# EAGLE design tiny_encoder_board (EAGLE 9.4.2)

## Sheet 1 of 3
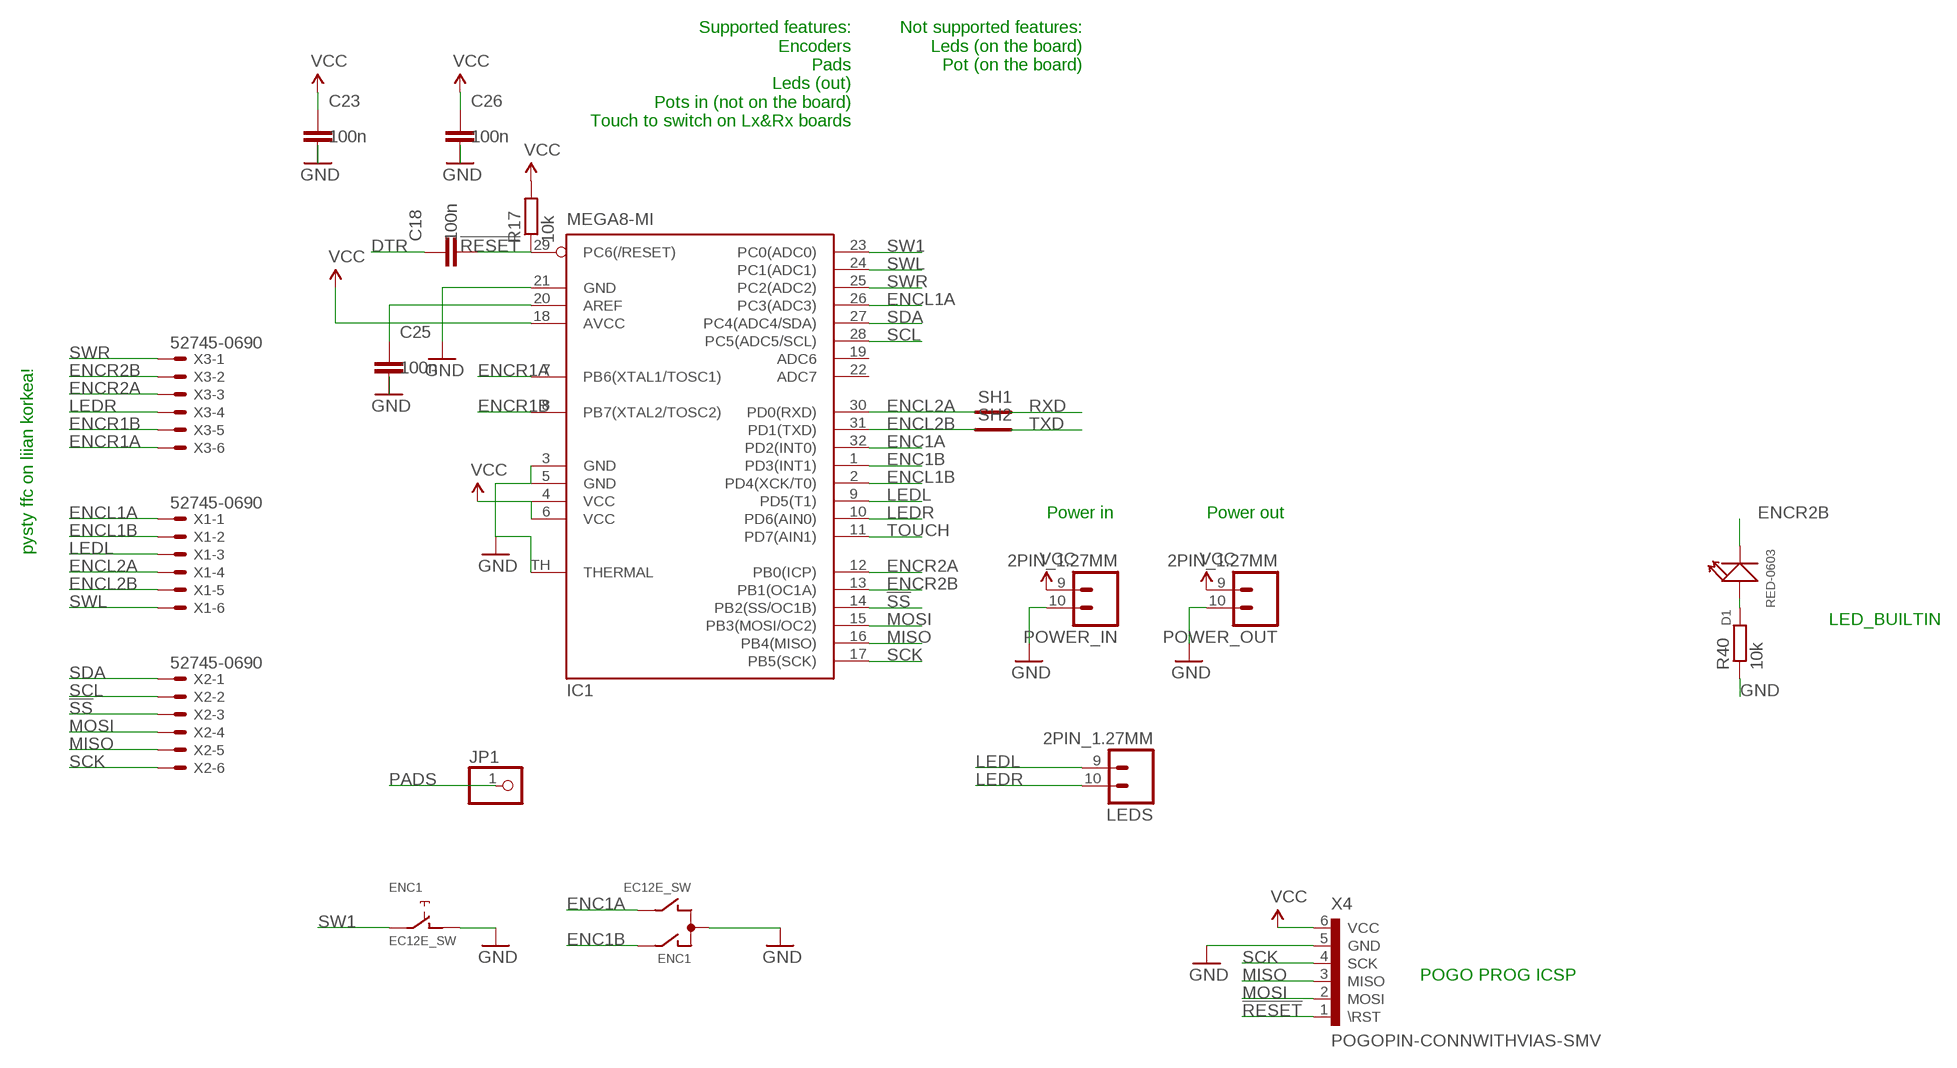
[diagram p0: schematic, sheet 1]

### Parts
C18  100n  C-EUC0402  [C0402]
C23  100n  C-EUC0402  [C0402]
C25  100n  C-EUC0402  [C0402]
C26  100n  C-EUC0402  [C0402]
D1  RED-0603  LED-SMD-RED-DIFFUSED(0603)  [LED-0603]
ENC1  EC12E_SW  [ALPS_EC12E_SW]
IC1  MEGA8-MI  [MLF32-TH]
JP1  PINHD-1X1  [1X01]
LEDS  2PIN_1.27MM  [1X02_1.27MM_NO_SILK]
POWER_IN  2PIN_1.27MM  [1X02_1.27MM_NO_SILK]
POWER_OUT  2PIN_1.27MM  [1X02_1.27MM_NO_SILK]
R17  10k  R-EU_R0402  [R0402]
R40  10k  R-EU_R0402  [R0402]
SH1  SHORT  [SHORT_TOP_8MIL]
SH2  SHORT  [SHORT_TOP_8MIL]
X1  52745-0690  [52745-0690]
X2  52745-0690  [52745-0690]
X3  52745-0690  [52745-0690]
X4  POGOPIN-CONNWITHVIAS-SMV  [POGOPROG-CONN-OH-SMALLERVIAS]

### Nets
!RESET: C18.2 IC1.29(PC6(/RESET)) R17.1 X4.1(\RST)
!SS: IC1.14(PB2(SS/OC1B)) X2.3
AREF: C25.1 IC1.20(AREF)
DTR: C18.1
ENC1A: ENC1.B IC1.32(PD2(INT0)) ; also sheet 3
ENC1B: ENC1.A IC1.1(PD3(INT1)) ; also sheet 3
ENCL1A: IC1.26(PC3(ADC3)) X1.1 ; also sheet 3
ENCL1B: IC1.2(PD4(XCK/T0)) X1.2 ; also sheet 3
ENCL2A: IC1.30(PD0(RXD)) SH1.P$1 X1.4 ; also sheet 3
ENCL2B: IC1.31(PD1(TXD)) SH2.P$1 X1.5 ; also sheet 3
ENCR1A: IC1.7(PB6(XTAL1/TOSC1)) X3.6 ; also sheet 3
ENCR1B: IC1.8(PB7(XTAL2/TOSC2)) X3.5 ; also sheet 3
ENCR2A: IC1.12(PB0(ICP)) X3.3 ; also sheet 3
ENCR2B: D1.- IC1.13(PB1(OC1A)) X3.2 ; also sheet 3
GND: C23.2 C25.2 C26.2 ENC1.C ENC1.D IC1.3(GND) IC1.5(GND) IC1.21(GND) IC1.TH(THERMAL) POWER_IN.10 POWER_OUT.10 R40.1 X4.5(GND) ; also sheet 2
LEDL: IC1.9(PD5(T1)) LEDS.9 X1.3
LEDR: IC1.10(PD6(AIN0)) LEDS.10 X3.4
MISO: IC1.16(PB4(MISO)) X2.5 X4.3(MISO) ; also sheet 2
MOSI: IC1.15(PB3(MOSI/OC2)) X2.4 X4.2(MOSI) ; also sheet 2
N$31: D1.+ R40.2
PADS: JP1.1 ; also sheet 3
RXD: SH1.P$2
SCK: IC1.17(PB5(SCK)) X2.6 X4.4(SCK) ; also sheet 2
SCL: IC1.28(PC5(ADC5/SCL)) X2.2
SDA: IC1.27(PC4(ADC4/SDA)) X2.1
SW1: ENC1.E IC1.23(PC0(ADC0)) ; also sheet 3
SWL: IC1.24(PC1(ADC1)) X1.6 ; also sheet 3
SWR: IC1.25(PC2(ADC2)) X3.1 ; also sheet 3
TOUCH: IC1.11(PD7(AIN1)) ; also sheet 3
TXD: SH2.P$2
VCC: C23.1 C26.1 IC1.4(VCC) IC1.6(VCC) IC1.18(AVCC) POWER_IN.9 POWER_OUT.9 R17.2 X4.6(VCC)
Unconnected: ENC1.GND1(G) ENC1.GND2(G) IC1.19(ADC6) IC1.22(ADC7)

### Notes on the sheet
- Supported features:
  Encoders
  Pads
  Leds (out)
  Pots in (not on the board)
  Touch to switch on Lx&Rx boards
- Not supported features:
  Leds (on the board)
  Pot (on the board)
- Power in | Power out
- pysty ffc on liian korkea!
- LED_BUILTIN
- POGO PROG ICSP

## Sheet 2 of 3
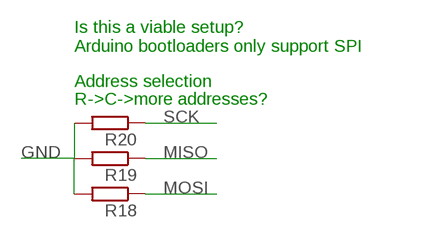
[diagram p1: schematic, sheet 2]

### Parts
R18  R-EU_R0402  [R0402]
R19  R-EU_R0402  [R0402]
R20  R-EU_R0402  [R0402]

### Nets
GND: R18.2 R19.2 R20.2 ; also sheet 1
MISO: R19.1 ; also sheet 1
MOSI: R18.1 ; also sheet 1
SCK: R20.1 ; also sheet 1

### Notes on the sheet
- Is this a viable setup?
  Arduino bootloaders only support SPI
- Address selection
- R->C->more addresses?

## Sheet 3 of 3
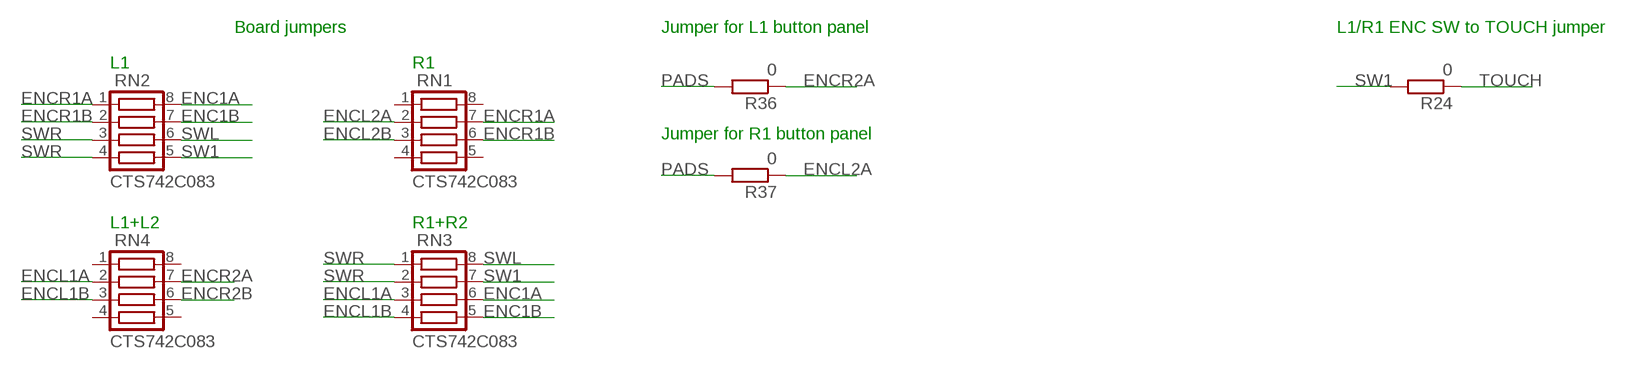
[diagram p2: schematic, sheet 3]

### Parts
R24  0  R-EU_R0402  [R0402]
R36  0  R-EU_R0603  [R0603]
R37  0  R-EU_R0402  [R0402]
RN1  CTS742C083  [CTS742C083]
RN2  CTS742C083  [CTS742C083]
RN3  CTS742C083  [CTS742C083]
RN4  CTS742C083  [CTS742C083]

### Nets
ENC1A: RN2.8 RN3.6 ; also sheet 1
ENC1B: RN2.7 RN3.5 ; also sheet 1
ENCL1A: RN3.3 RN4.2 ; also sheet 1
ENCL1B: RN3.4 RN4.3 ; also sheet 1
ENCL2A: R37.1 RN1.2 ; also sheet 1
ENCL2B: RN1.3 ; also sheet 1
ENCR1A: RN1.7 RN2.1 ; also sheet 1
ENCR1B: RN1.6 RN2.2 ; also sheet 1
ENCR2A: R36.1 RN4.7 ; also sheet 1
ENCR2B: RN4.6 ; also sheet 1
PADS: R36.2 R37.2 ; also sheet 1
SW1: R24.2 RN2.5 RN3.7 ; also sheet 1
SWL: RN2.6 RN3.8 ; also sheet 1
SWR: RN2.3 RN2.4 RN3.1 RN3.2 ; also sheet 1
TOUCH: R24.1 ; also sheet 1
Unconnected: RN1.1 RN1.4 RN1.5 RN1.8 RN4.1 RN4.4 RN4.5 RN4.8

### Notes on the sheet
- Board jumpers | Jumper for L1 button panel | L1/R1 ENC SW to TOUCH jumper
- L1 | R1
- Jumper for R1 button panel
- L1+L2 | R1+R2

## Library data of the parts
C18 C23 C25 C26 = rcl:C-EU: CAPACITOR, European symbol; SPICEPREFIX: C
D1 = Seeed-LED-2016:LED-SMD-RED-DIFFUSED(0603): 304090042; MPN: 19-217-R6C-AL1M2VY-3T
ENC1 = switch_pec:EC12E_SW: ALPS rotary Encoder EC12E series with switch; MPN: EC12E2424407; OC_FARNELL: 1520813; OC_NEWARK: 74M1068
IC1 = atmel:MEGA8-MI: MICROCONTROLLER 8 Kbytes FLASH, 1 kbytes SRAM, 512 bytes EEPROM, USART, 6-channel 10 bit ADC, 2-channel 8 bit ADC Pin compatible with Atmega48, ATMega88, ATMega168 Source: avr.lbr; MPN: ATMEGA88PA-MU; OC_FARNELL: 1715491; OC_NEWARK: 15R0272
JP1 = pinhead_plus:PINHD-1X1: PIN HEADER
LEDS POWER_IN POWER_OUT = edge:2PIN_1.27MM
R17-R20 R24 R36 R37 R40 = rcl:R-EU_: RESISTOR, European symbol; SPICEPREFIX: R
RN1-RN4 = resistor-net:CTS742C083: Chip Resistor Array 4 Single Resistor Source: http://www.ctscorp.com/components/Datasheets/CTSChipArrayDs.pdf; OC_FARNELL: unknown; OC_NEWARK: unknown
SH1 SH2 = shorts:SHORT: Short between two nets
X1-X3 = i2c_encoder:52745-0690: FFC/FPC-to-Board 0.50mm (.020") SMT Top Contact Right Angle, ZIF, Style Receptacle 52745 / 52435 Source: http://www.molex.com/product/ffc/52745.html; MF: MOLEX; MPN: 52745-0690; OC_FARNELL: unknown; OC_NEWARK: 92M6374
X4 = Protofusion:POGOPIN-CONN: Protofusion custom pogo pin programming header

## Board
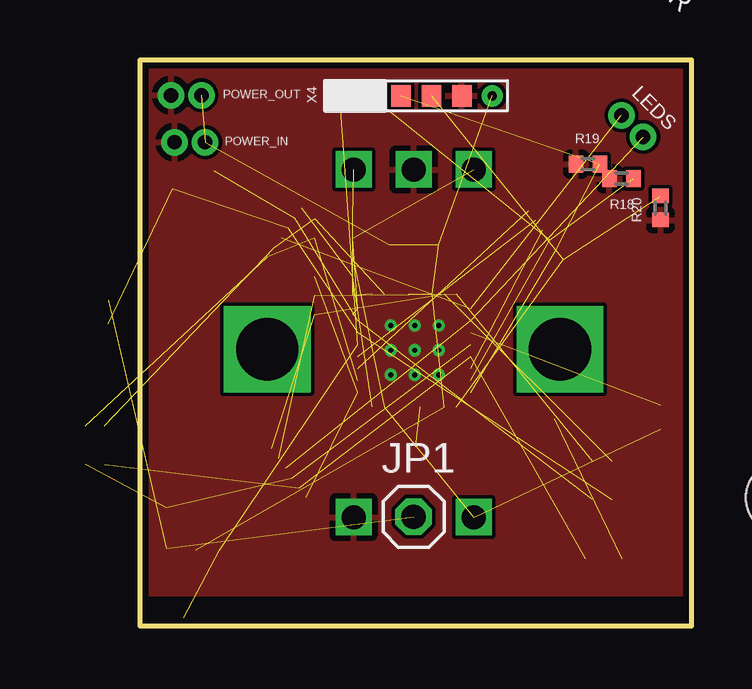
[diagram p3: board, top side]
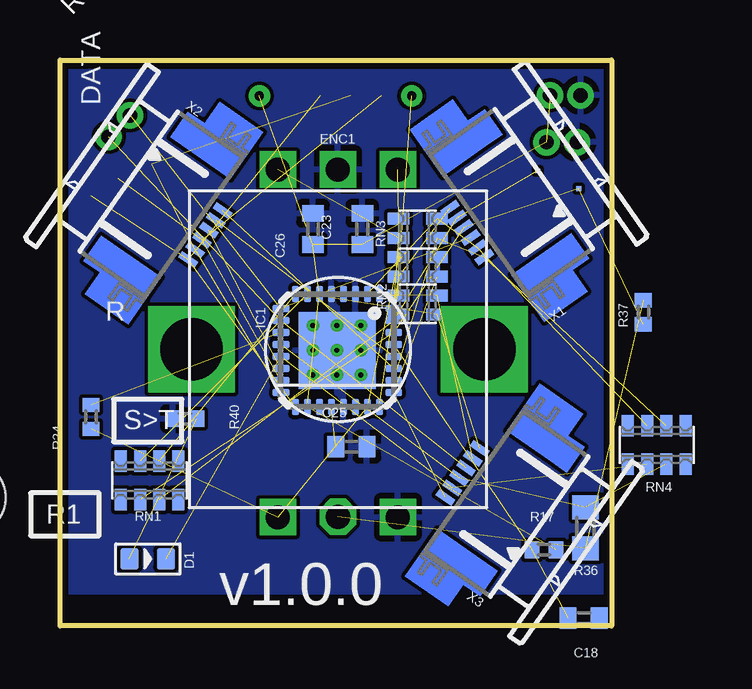
[diagram p4: board, bottom side, seen from below]

Size 22.99 x 23.6 mm. Coordinates in mm from the lower left corner, seen from the top.
Outline: 0,0 22.99,0 22.99,23.6 0,23.6 0,0
Copper layers (1*16): Top 0.035mm / dielectric 1.5mm / Bottom 0.035mm
Design rules "SeeedStudio_2layer_DRU_no_angle_20140221 *": minimum track width 4mil, minimum drill 0.2mm, track to track 6mil, track to pad 6mil, pad to pad 6mil, via to via 6mil, smd to smd 0mil, copper to edge 10mil, drill to drill 10mil, minimum pad ring 10mil, minimum via ring 6mil, stop-mask expansion 2mil, vias tented up to drill 100mil, thermal gap 10mil
Holes 3 mm at 26.75,5.34 -0.84,27.91

### Footprints (pad centres in the part's own frame; a part is rotated, then mirrored left to right if it is on the bottom)
C0402 = smd 0.7 x 0.9: 1 -0.65,0; 2 0.65,0
LED-0603 = smd 0.762 x 0.889: + -0.762,0; - 0.762,0
ALPS_EC12E_SW = drill 1 square: A -2.5,-7.5; B 2.5,-7.5; C 0,-7.5; D -2.5,7; E 2.5,7 | drill 2.6 square: GND1 -6.1,0; GND2 6.1,0
MLF32-TH = smd 0.7 x 0.3: 1 -2.35,1.75; 2 -2.35,1.25; 3 -2.35,0.75; 4 -2.35,0.25; 5 -2.35,-0.25; 6 -2.35,-0.75; 7 -2.35,-1.25; 8 -2.35,-1.75; 17 2.35,-1.75; 18 2.35,-1.25; 19 2.35,-0.75; 20 2.35,-0.25; 21 2.35,0.25; 22 2.35,0.75; 23 2.35,1.25; 24 2.35,1.75 | smd 0.3 x 0.7: 9 -1.75,-2.35; 10 -1.25,-2.35; 11 -0.75,-2.35; 12 -0.25,-2.35; 13 0.25,-2.35; 14 0.75,-2.35; 15 1.25,-2.35; 16 1.75,-2.35; 25 1.75,2.35; 26 1.25,2.35; 27 0.75,2.35; 28 0.25,2.35; 29 -0.25,2.35; 30 -0.75,2.35; 31 -1.25,2.35; 32 -1.75,2.35 | smd 3.2 x 3.2: TH 0,0
1X01 = drill 1.016 octagon: 1 0,0
1X02_1.27MM_NO_SILK = drill 0.6: 9 0,0; 10 1.27,0
R0402 = smd 0.6 x 0.7: 1 -0.5,0; 2 0.5,0
R0603 = smd 1 x 1.1: 1 -0.85,0; 2 0.85,0
CTS742C083 = smd 0.5 x 0.9: 1 -1.2,-0.8; 2 -0.4,-0.8; 3 0.4,-0.8; 4 1.2,-0.8; 5 1.2,0.8; 6 0.4,0.8; 7 -0.4,0.8; 8 -1.2,0.8
SHORT_TOP_8MIL = smd 0.203 x 0.203: P$1 0,0; P$2 0,0
52745-0690 = smd 0.3 x 0.8: 1 -1.25,2.5; 2 -0.75,2.5; 3 -0.25,2.5; 4 0.25,2.5; 5 0.75,2.5; 6 1.25,2.5
POGOPROG-CONN-OH-SMALLERVIAS = drill 0.381: 1 0,2.54; 6 0,-3.81 | smd 0.889 x 0.813: 2 0,1.27; 3 0,0; 4 0,-1.27; 5 0,-2.54

### Placement (x,y rotation side)
C18  1.17,0.33 180 bottom
C23  10.39,16.55 90 bottom
C25  10.85,7.47 0 bottom
C26  12.45,16.55 90 bottom
D1  19.33,2.79 0 bottom
ENC1  11.4,11.53 180 bottom
IC1  11.43,11.48 270 bottom
JP1  11.4,4.55 0 top
LEDS  20.07,21.29 315 top
POWER_IN  2.72,20.17 0 bottom
POWER_OUT  2.57,22.12 180 top
R17  2.82,3.17 0 bottom
R18  20.07,18.64 180 top
R19  18.67,19.25 180 top
R20  21.69,17.42 270 top
R24  21.69,8.71 270 bottom
R36  1.09,4.09 270 bottom
R37  -1.32,13.08 90 bottom
R40  17.78,8.64 0 bottom
RN1  19.25,6.07 0 bottom
RN2  8.08,14.17 90 bottom
RN3  8.08,15.77 90 bottom
RN4  -1.88,7.54 180 bottom
SH1  1.37,18.24 0 bottom
SH2  3.07,18.97 0 bottom
X1  3.98,17.83 125 bottom
X2  18.97,17.73 235 bottom
X3  4.17,4.94 55 bottom
X4  10.87,22.1 90 top

### Tracks (layer width: path | path; a pad name or v marks a point on that pad's centre or on a via)
!RESET  (3 unrouted)
!SS  (1 unrouted)
AREF  (1 unrouted)
ENC1A  (3 unrouted)
ENC1B  (3 unrouted)
ENCL1A  (3 unrouted)
ENCL1B  (3 unrouted)
ENCL2A  (4 unrouted)
ENCL2B  (3 unrouted)
  Bottom 0.203: RN1.3
ENCR1A  (3 unrouted)
ENCR1B  (3 unrouted)
ENCR2A  (3 unrouted)
ENCR2B  (3 unrouted)
  Bottom 0.203: RN4.6 -1.46,6.73
GND  (via drill 0.2)
  other vias: 10.45,10.47 12.45,10.47 10.45,11.49 11.45,11.49 12.45,11.49 10.45,12.52 12.45,12.52 11.45,12.52 11.45,10.47
  pour Top: -7.19,31.27 29.87,31.27 29.87,1.3 -7.19,1.3
  pour Bottom: -7.19,31.12 29.82,31.12 29.82,1.37 -7.19,1.37
LEDL  (2 unrouted)
LEDR  (2 unrouted)
MISO  (3 unrouted)
MOSI  (3 unrouted)
N$31  (1 unrouted)
PADS  (2 unrouted)
SCK  (3 unrouted)
SCL  (1 unrouted)
SDA  (1 unrouted)
SW1  (3 unrouted)
  Bottom 0.203: RN3.7
SWL  (2 unrouted)
  Bottom 0.203: RN3.8
SWR  (2 unrouted)
  Bottom 0.203: RN2.4 RN2.3 | RN2.4 | RN2.3
TOUCH  (1 unrouted)
VCC  (8 unrouted)

### Text on the board
tPlace: L | R
bPlace: L | R | DATA | R | S>T | R1
bNames: v1.0.0
Document: the height of an SK6812 is 1.6mm where / as the height for a smd encoder is ~4.5mm | use WS2812B or SK6812 to save on gpio pins | GPIO needed: / I2C: 2 / SPI: 4 (+ interrupt?) / encoder: 2 / leds: 1 / = 5 - 7(/8) | (c> 2 1.9) | 0.5mm FFC max current = 0.55A / http://www.axon-cable.com/publications/FFC-Flat-Cables.pdf | F+M headerit päällekkäin on noin 5.1mm? | kooderin korkeus 4+(5-7 kierteet)mm